# Altium project Charger_V01.PrjPcb
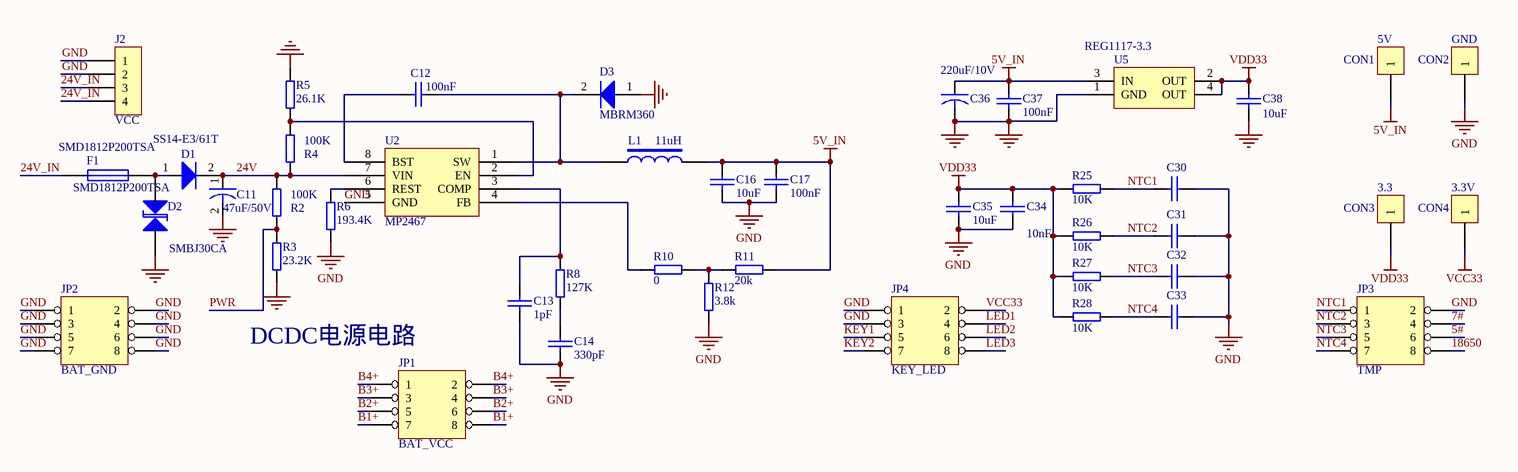
[diagram p0: Charger_Power_V01.SchDoc]
3 sheets, 103 parts. Net scope: global (net labels, ports and power ports of the same name join across sheets).
Board file: Chargerv01.PcbDoc
Sheets:
  Charger_Power_V01.SchDoc
  Charger_MCU_V01.SchDoc
  Charger_BIC_V01.SchDoc

## Sheet Charger_Power_V01.SchDoc
size A4

### Parts
(Parts that share a designator on the sheet are numbered #1, #2 ... from top to bottom, then left to right.)
3.3  CON3  [TP1]
3.3V  CON4  [TP1]
5V  CON1  [TP1]
C11  value 47uF/50V  [C1206]  (hidden comment: UUD1H470MCL1GS)
C12  value 100nF  [C0603]  (hidden comment: CC0603JRNPO9BN471)
C13  value 1pF  [C0603]  (hidden comment: CC0603JRNPO9BN471)
C14  value 330pF  [C0603]  (hidden comment: CC0603JRNPO9BN471)
C16  value 10uF  [C0805]  (hidden comment: CC0805ZKY5V6BB106)
C17  value 100nF  [C0603]  (hidden comment: CC0603JRNPO9BN471)
C30  C0603  [C0603]  (value not drawn)
C31  C0603  [C0603]  (value not drawn)
C32  C0603  [C0603]  (value not drawn)
C33  C0603  [C0603]  (value not drawn)
C34  value 10nF  [C0603]  (hidden comment: CC0603KRX7R9BB103)
C35  value 10uF  [C0805]  (hidden comment: CC0805ZKY5V6BB106)
C36  value 220uF/10V  [C6032]  (hidden comment: TAJC227K010RNJ)
C37  value 100nF  [C0603]  (hidden comment: CC0603ZRY5V9BB104)
C38  value 10uF  [C0805]  (hidden comment: CC0805ZKY5V6BB106)
D1  SS14-E3/61T  [D3528]
D2  SMBJ30CA  [D3528]
D3  value MBRM360  [D3528]  (hidden comment: SS14-E3/61T)
F1  SMD1812P200TSA  [R1812]
GND  CON2  [TP1]
J2  VCC  [SWIP4-2.54]
JP1  BAT_VCC  [IDC8(2.0mm)]
JP2  BAT_GND  [IDC8(2.0mm)]
JP3  TMP  [IDC8(2.0mm)]
JP4  KEY_LED  [IDC8(2.54mm)]
L1  value 11uH  [CD52]  (hidden comment: CD54NP-221KC)
R2  value 100K  [R0603]  (hidden comment: RC0603JR-071KL)
R3  value 23.2K  [R0603]  (hidden comment: RC0603JR-073KL)
R4  value 100K  [R0603]  (hidden comment: RC0603JR-071KL)
R5  value 26.1K  [R0603]  (hidden comment: RC0603JR-073KL)
R6  value 193.4K  [R0603]  (hidden comment: RC0603JR-073KL)
R8  value 127K  [R0603]  (hidden comment: RC0603JR-073KL)
R10  value 0  [R0603]  (hidden comment: RC0603JR-071KL)
R11  value 20k  [R0603]  (hidden comment: RC0603JR-071KL)
R12  value 3.8k  [R0603]  (hidden comment: RC0603JR-071KL)
R25  value 10K  [R0603]  (hidden comment: RC0603JR-0710KL)
R26  value 10K  [R0603]  (hidden comment: RC0603JR-0710KL)
R27  value 10K  [R0603]  (hidden comment: RC0603JR-0710KL)
R28  value 10K  [R0603]  (hidden comment: RC0603JR-0710KL)
U2  MP2467  [SO8]
U5#1  value REG1117-3.3  [SOT223]  (hidden comment: REG1117-3.3/2K5)

### Nets
5V_IN: 5V.1 C16.2 C17.1 C36.1 C37.2 L1.2 R11.1 U5#1.3(IN)
GND: C11.2 C13.1 C14.1 C16.1 C17.2 C30.1 C31.1 C32.1 C33.1 C34.2 C35.2 C36.2 C37.1 C38.2 D2.1 D3.1 GND.1 J2.1 J2.2 JP2.1 JP2.2 JP2.3 JP2.4 JP2.5 JP2.6 JP2.7 JP2.8 JP3.2 JP4.1 JP4.3 R3.1 R5.1 R6.2 R12.2 U2.5(GND) U5#1.1(GND)
VCC33: 3.3V.1 JP4.2
VDD33: 3.3.1 C34.1 C35.1 C38.1 R25.1 R26.1 R27.1 R28.1 U5#1.2(OUT) U5#1.4(OUT)
5#: JP3.6
7#: JP3.4
24V: C11.1 D1.2 R2.2 R4.1 U2.7(VIN)
24V_IN: F1.1 J2.3 J2.4
18650: JP3.8
B1+: JP1.7 JP1.8
B2+: JP1.5 JP1.6
B3+: JP1.3 JP1.4
B4+: JP1.1 JP1.2
KEY1: JP4.5
KEY2: JP4.7
LED1: JP4.4
LED2: JP4.6
LED3: JP4.8
NTC1: C30.2 JP3.1 R25.2
NTC2: C31.2 JP3.3 R26.2
NTC3: C32.2 JP3.5 R27.2
NTC4: C33.2 JP3.7 R28.2
PWR: R2.1 R3.2
NetC12_1: C12.1 U2.8(BST)
NetC12_2: C12.2 D3.2 L1.1 U2.1(SW)
NetC13_2: C13.2 R8.2 U2.3(COMP)
NetC14_2: C14.2 R8.1
NetD1_1: D1.1 D2.2 F1.2
NetR4_2: R4.2 R5.2 U2.2(EN)
NetR6_1: R6.1 U2.6(REST)
NetR10_1: R10.1 R11.2 R12.1
NetR10_2: R10.2 U2.4(FB)

### Notes on the sheet
- DCDC电源电路

### Library data of the parts
3.3 3.3V 5V GND = CON1: Connector
C11 = CAP_SMD_47uF/50V: CAP ALUM 47UF 50V 20% SMD; Manufacturer: Nichicon; Unit Cost: 0.3; Category: Capacitors; Manufacturer Part Number: UUD1H470MCL1GS; Part Number: UUD1H470MCL1GS; RoHs: Lead free / RoHS Compliant; Subcategory: Aluminum Capacitors
C12-C14 C17 = C0603_470p: CAP CER 470PF 50V 5% NPO 0603; Manufacturer: Yageo; Unit Cost: 0.04; Category: Capacitors; Manufacturer Part Number: CC0603JRNPO9BN471; Part Number: CC0603JRNPO9BN471; RoHs: Lead free / RoHS Compliant; Subcategory: Ceramic Capacitors
C16 C35 C38 = C0805_10uF: CAP CER 10UF 10V Y5V 0805; Manufacturer: Yageo; Unit Cost: 0.08; Category: Capacitors; Manufacturer Part Number: CC0805ZKY5V6BB106; Part Number: CC0805ZKY5V6BB106; RoHs: Lead free / RoHS Compliant; Subcategory: Ceramic Capacitors
C30-C33 = C0603: Unit Cost: 0.04
C34 = C0603_10nF: CAP CER 10000PF 50V 10% X7R 0603; Manufacturer: Yageo; Unit Cost: 0.04; Category: Capacitors; Manufacturer Part Number: CC0603KRX7R9BB103; Part Number: CC0603KRX7R9BB103; RoHs: Lead free / RoHS Compliant; Subcategory: Ceramic Capacitors
C36 = C6032_220uF_10V: CAP TANT 220UF 10V 10% 2312; Manufacturer: AVX Corporation; Unit Cost: 0.3; Category: Capacitors; Manufacturer Part Number: TAJC227K010RNJ; Part Number: TAJC227K010RNJ; RoHs: Lead free / RoHS Compliant; Subcategory: Tantalum Capacitors
C37 = C0603_100nF: CAP CER 0.1UF 50V Y5V 0603; Manufacturer: Yageo; Unit Cost: 0.04; Category: Capacitors; Manufacturer Part Number: CC0603ZRY5V9BB104; Part Number: CC0603ZRY5V9BB104; Subcategory: Ceramic Capacitors
D1 D3 = D3528_SS14: DIODE SCHOTTKY 40V 1A DO214AC; Manufacturer: Vishay; Unit Cost: 0.2; Category: Diodes; Manufacturer Part Number: SS14-E3/61T; Part Number: SS14-E3/61T; Subcategory: Diodes, Rectifiers - Single
  D1: Value: SS14-E3/61T
D2 = D3528_TVS_30: TVS DIODE 30VWM 48.4VC SMB; Manufacturer: Littelfuse Inc; Unit Cost: 0.3; Category: Circuit Protection; Manufacturer Part Number: SMBJ30CA; Part Number: SMBJ30CA; Subcategory: TVS - Diodes; Value: SMBJ30CA
F1 = FUSE1: FUSE RESETTABLE 2A  1812; Manufacturer: Littelfuse Inc; Unit Cost: 0.25; Category: Circuit Protection; Manufacturer Part Number: SMD1812P200TSA; Part Number: SMD1812P200TSA; Subcategory: Fuses; Value: SMD1812P200TSA
J2 = CON4: Connector
JP1 JP2 = HEADER 4X2-IDC8
JP3 = HEADER 4X2-IDC8: Value: NTC
JP4 = HEADER 4X2(2.54mm)
L1 = INDUCTOR_CD54: INDUCTOR POWER 220UH 10% SMD; Manufacturer: Sumida America Components Inc; Unit Cost: 0.4; Category: Inductors; Manufacturer Part Number: CD54NP-221KC; Part Number: CD54NP-221KC; Subcategory: Fixed Inductors
R2 R4 R10-R12 = R0603_1K_5%: RES 1.0K OHM 1/10W 5% 0603 SMD; Manufacturer: Yageo; Unit Cost: 0.005; Category: Resistor; Manufacturer Part Number: RC0603JR-071KL; Part Number: RC0603JR-071KL; RoHs: Lead free / RoHS Compliant; Subcategory: ThickFilm
R3 R5 R6 R8 = R0603_3K_5%: RES 3.0K OHM 1/10W 5% 0603 SMD; Manufacturer: Yageo; Unit Cost: 0.005; Category: Resistor; Manufacturer Part Number: RC0603JR-073KL; Part Number: RC0603JR-073KL; RoHs: Lead free / RoHS Compliant; Subcategory: ThickFilm
R25-R28 = R0603_10K_5%: RES 10K OHM 1/10W 5% 0603 SMD; Manufacturer: Yageo; Unit Cost: 0.005; Category: Resistor; Manufacturer Part Number: RC0603JR-0710KL; Part Number: RC0603JR-0710KL; RoHs: Lead free / RoHS Compliant; Subcategory: ThickFilm
U2 = MP2467: input range:6-36V; Manufacturer: Analog; Value: IN:6-36V;OUTmax:30V; Category: Integrated Circuits (ICs); Manufacturer Part Number: MP2467; Part Number: MP2467; Subcategory: IN:6-36V
U5#1 = REG1117-3.3: IC REG LDO 3.3V 0.8A SOT223; Manufacturer: Texas Instruments; Category: Integrated Circuits (ICs); Manufacturer Part Number: REG1117-3.3/2K5; Part Number: REG1117-3.3/2K5; RoHs: Lead free / RoHS Compliant; Subcategory: PMIC - Voltage Regulators - Linear (LDO)

## Sheet Charger_MCU_V01.SchDoc
size A4
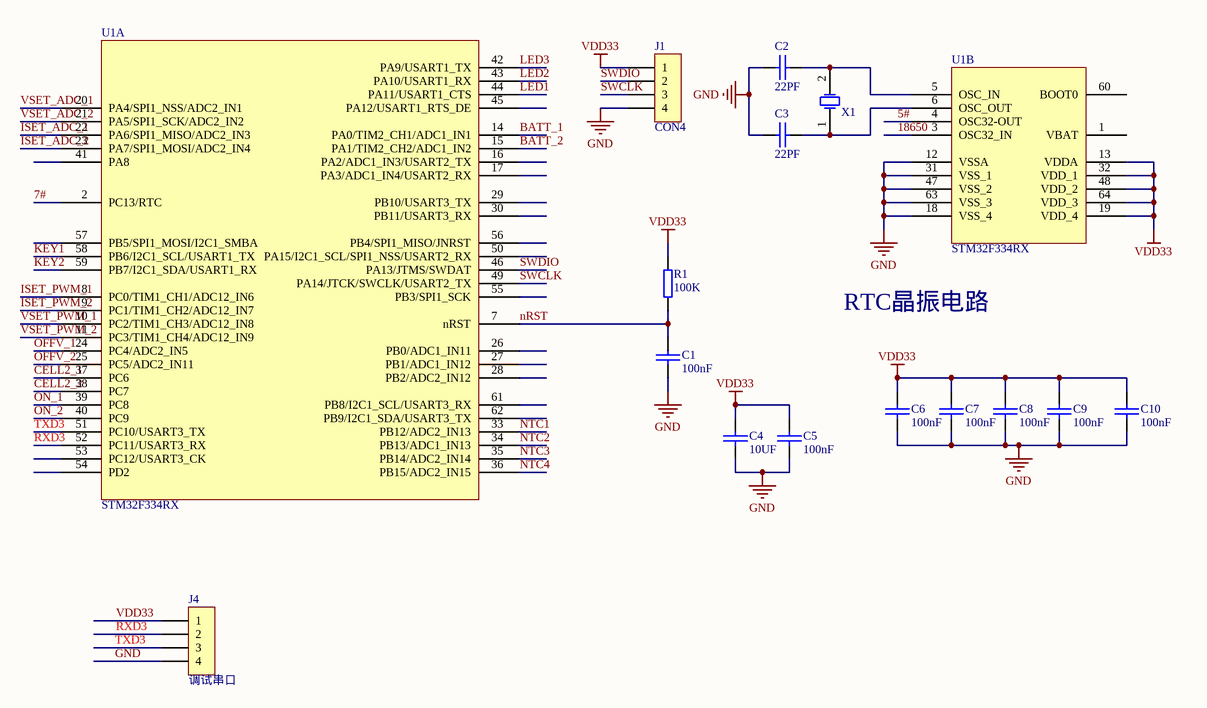
[diagram p1: Charger_MCU_V01.SchDoc]

### Parts
C1  value 100nF  [C0603]  (hidden comment: CC0603ZRY5V9BB104)
C2  value 22PF  [C0603]  (hidden comment: C0603)
C3  value 22PF  [C0603]  (hidden comment: C0603)
C4  value 10UF  [C0603]  (hidden comment: CC0603ZRY5V9BB106)
C5  value 100nF  [C0603]  (hidden comment: CC0603ZRY5V9BB104)
C6  value 100nF  [C0603]  (hidden comment: CC0603ZRY5V9BB104)
C7  value 100nF  [C0603]  (hidden comment: CC0603ZRY5V9BB104)
C8  value 100nF  [C0603]  (hidden comment: CC0603ZRY5V9BB104)
C9  value 100nF  [C0603]  (hidden comment: CC0603ZRY5V9BB104)
C10  value 100nF  [C0603]  (hidden comment: CC0603ZRY5V9BB104)
J1  CON4  [SIP4]
J4  调试串口  [SIP4]
R1  value 100K  [R0603]  (hidden comment: R0603)
U1  value STM32F334RX  [LQFP64]  (hidden comment: STM32F103R8T6)  (parts A,B of 2)
X1  9C-8.000MBBK-T  [XTAL2]  (value not drawn)

### Nets
GND: C1.2 C2.1 C3.1 C4.2 C5.2 C6.2 C7.2 C8.2 C9.2 C10.2 J1.4 J4.4 U1.12(VSSA) U1.18(VSS_4) U1.31(VSS_1) U1.47(VSS_2) U1.63(VSS_3)
VDD33: C4.1 C5.1 C6.1 C7.1 C8.1 C9.1 C10.1 J1.1 J4.1 R1.2 U1.13(VDDA) U1.19(VDD_4) U1.32(VDD_1) U1.48(VDD_2) U1.64(VDD_3)
5#: U1.4(OSC32-OUT)
7#: U1.2(PC13/RTC)
18650: U1.3(OSC32_IN)
BATT_1: U1.14(PA0/TIM2_CH1/ADC1_IN1)
BATT_2: U1.15(PA1/TIM2_CH2/ADC1_IN2)
CELL2_1: U1.37(PC6)
CELL2_2: U1.38(PC7)
ISET_ADC_1: U1.22(PA6/SPI1_MISO/ADC2_IN3)
ISET_ADC_2: U1.23(PA7/SPI1_MOSI/ADC2_IN4)
ISET_PWM_1: U1.8(PC0/TIM1_CH1/ADC12_IN6)
ISET_PWM_2: U1.9(PC1/TIM1_CH2/ADC12_IN7)
KEY1: U1.58(PB6/I2C1_SCL/USART1_TX)
KEY2: U1.59(PB7/I2C1_SDA/USART1_RX)
LED1: U1.44(PA11/USART1_CTS)
LED2: U1.43(PA10/USART1_RX)
LED3: U1.42(PA9/USART1_TX)
nRST: C1.1 R1.1 U1.7(nRST)
NTC1: U1.33(PB12/ADC2_IN13)
NTC2: U1.34(PB13/ADC1_IN13)
NTC3: U1.35(PB14/ADC2_IN14)
NTC4: U1.36(PB15/ADC2_IN15)
OFFV_1: U1.24(PC4/ADC2_IN5)
OFFV_2: U1.25(PC5/ADC2_IN11)
ON_1: U1.39(PC8)
ON_2: U1.40(PC9)
RXD3: J4.2 U1.52(PC11/USART3_RX)
SWCLK: J1.3 U1.49(PA14/JTCK/SWCLK/USART2_TX)
SWDIO: J1.2 U1.46(PA13/JTMS/SWDAT)
TXD3: J4.3 U1.51(PC10/USART3_TX)
VSET_ADC_1: U1.20(PA4/SPI1_NSS/ADC2_IN1)
VSET_ADC_2: U1.21(PA5/SPI1_SCK/ADC2_IN2)
VSET_PWM_1: U1.10(PC2/TIM1_CH3/ADC12_IN8)
VSET_PWM_2: U1.11(PC3/TIM1_CH4/ADC12_IN9)
NetC2_2: C2.2 U1.5(OSC_IN) X1.2(OSC2)
NetC3_2: C3.2 U1.6(OSC_OUT) X1.1(OSC1)

Not connected (* = marked no-connect by the designer): U1 1(VBAT) 16(PA2/ADC1_IN3/USART2_TX) 17(PA3/ADC1_IN4/USART2_RX) 26(PB0/ADC1_IN11) 27(PB1/ADC1_IN12) 28(PB2/ADC2_IN12) 29(PB10/USART3_TX) 30(PB11/USART3_RX) 41(PA8) 45(PA12/USART1_RTS_DE) 50(PA15/I2C1_SCL/SPI1_NSS/USART2_RX) 53(PC12/USART3_CK) 54(PD2) 55(PB3/SPI1_SCK) 56(PB4/SPI1_MISO/JNRST) 57(PB5/SPI1_MOSI/I2C1_SMBA) 60(BOOT0) 61(PB8/I2C1_SCL/USART3_RX) 62(PB9/I2C1_SDA/USART3_TX)

### Notes on the sheet
- RTC晶振电路

### Library data of the parts
C1 = C0603: CAP CER 0.1UF 50V Y5V 0603; Manufacturer: Yageo; Unit Cost: 0.04; Category: Capacitors; Manufacturer Part Number: CC0603ZRY5V9BB104; Part Number: CC0603ZRY5V9BB104
C2 C3 = C0603: CAP CER 22PF 50V Y5V 0603; Unit Cost: 0.04; Category: Capacitors
C4 = C0603: CAP CER 10UF 50V Y5V 0603; Manufacturer: Yageo; Unit Cost: 0.04; Category: Capacitors; Manufacturer Part Number: CC0603ZRY5V9BB106; Part Number: CC0603ZRY5V9BB106
C5-C10 = C0603: CAP CER 100nF 50V Y5V 0603; Manufacturer: Yageo; Unit Cost: 0.04; Category: Capacitors; Manufacturer Part Number: CC0603ZRY5V9BB104; Part Number: CC0603ZRY5V9BB104
  C6: Subcategory: Ceramic Capacitors
J1 = CON4: 2.54mm 程序下载口
J4 = CON4: 2.54mm dip
R1 = R0603: RES 100K OHM 1/10W 5% 0603 SMD; Manufacturer: Yageo; Unit Cost: 0.005; Category: Resistor; RoHs: Lead free / RoHS Compliant; Subcategory: ThickFilm
U1 = STM32F334RX: MCU ARM 64KB FLASH MEM 64-LQFP; Manufacturer: STMicroelectronics; Unit Cost: 9.5; Category: Integrated Circuits (ICs); Manufacturer Part Number: STM32F103R8T6; Part Number: STM32F103R8T6; RoHs: Lead free / RoHS Compliant; Subcategory: STM32 F1
X1 = CRYSTAL-XTAL2: CRYSTAL 8.000MHZ 20PF SMD; Manufacturer: TXC CORPORATION; Value: 8M; Unit Cost: 0.25; Category: Crystals; Manufacturer Part Number: 9C-8.000MBBK-T; Part Number: 9C-8.000MBBK-T; RoHs: Lead free / RoHS Compliant; Subcategory: HC-49S

## Sheet Charger_BIC_V01.SchDoc
size A4
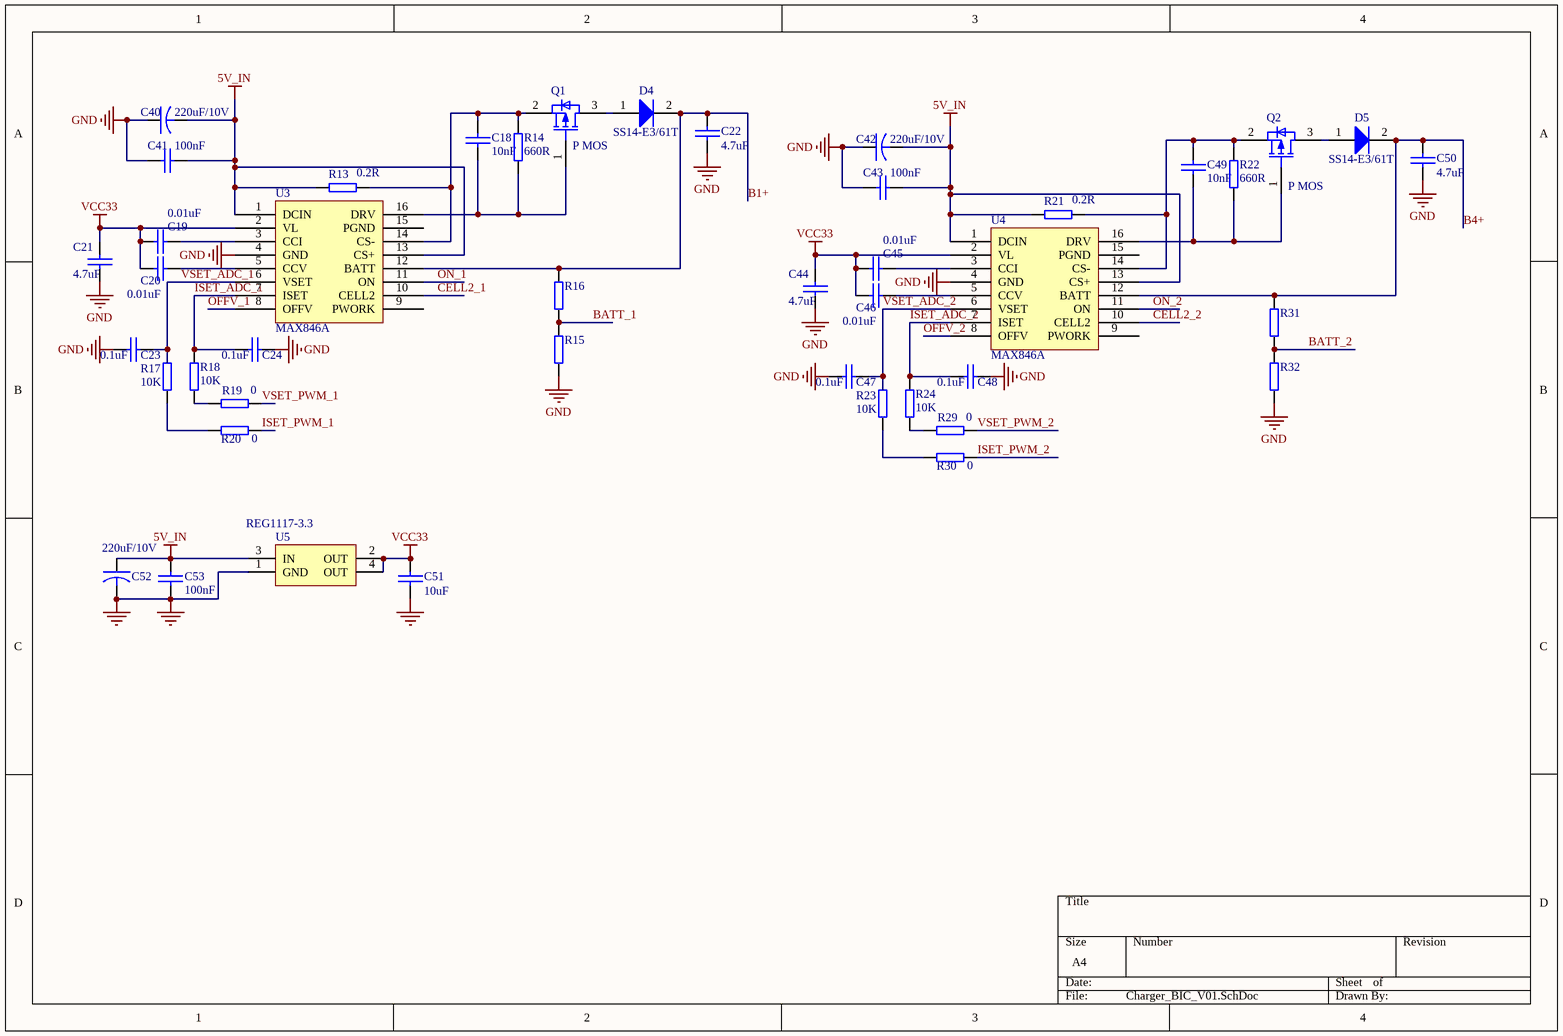
[diagram p2: Charger_BIC_V01.SchDoc]

### Parts
(Parts that share a designator on the sheet are numbered #1, #2 ... from top to bottom, then left to right.)
C18  value 10nF  [C0603]  (hidden comment: C0603)
C19  value 0.01uF  [C0603]  (hidden comment: C0603)
C20  value 0.01uF  [C0603]  (hidden comment: C0603)
C21  value 4.7uF  [C0603]  (hidden comment: C0603)
C22  value 4.7uF  [C0805]  (hidden comment: C0805)
C23  value 0.1uF  [C0603]  (hidden comment: C0603)
C24  value 0.1uF  [C0603]  (hidden comment: C0603)
C40  value 220uF/10V  [C6032]  (hidden comment: TAJC227K010RNJ)
C41  value 100nF  [C0603]  (hidden comment: CC0603ZRY5V9BB104)
C42  value 220uF/10V  [C6032]  (hidden comment: TAJC227K010RNJ)
C43  value 100nF  [C0603]  (hidden comment: CC0603ZRY5V9BB104)
C44  value 4.7uF  [C0603]  (hidden comment: C0603)
C45  value 0.01uF  [C0603]  (hidden comment: C0603)
C46  value 0.01uF  [C0603]  (hidden comment: C0603)
C47  value 0.1uF  [C0603]  (hidden comment: C0603)
C48  value 0.1uF  [C0603]  (hidden comment: C0603)
C49  value 10nF  [C0603]  (hidden comment: C0603)
C50  value 4.7uF  [C0805]  (hidden comment: C0805)
C51  value 10uF  [C0805]  (hidden comment: CC0805ZKY5V6BB106)
C52  value 220uF/10V  [C6032]  (hidden comment: TAJC227K010RNJ)
C53  value 100nF  [C0603]  (hidden comment: CC0603ZRY5V9BB104)
D4  SS14-E3/61T  [D3528]
D5  SS14-E3/61T  [D3528]
Q1  P MOS  [SOT23]
Q2  P MOS  [SOT23]
R13  value 0.2R  [R0603]  (hidden comment: R0603)
R14  value 660R  [R0603]  (hidden comment: RC0603JR-0720KL)
R15  R0603  [R0603]  (value not drawn)
R16  R0603  [R0603]  (value not drawn)
R17  value 10K  [R0603]  (hidden comment: RC0603JR-0710KL)
R18  value 10K  [R0603]  (hidden comment: RC0603JR-0710KL)
R19  value 0  [R0603]  (hidden comment: R0603)
R20  value 0  [R0603]  (hidden comment: R0603)
R21  value 0.2R  [R0603]  (hidden comment: R0603)
R22  value 660R  [R0603]  (hidden comment: RC0603JR-0720KL)
R23  value 10K  [R0603]  (hidden comment: RC0603JR-0710KL)
R24  value 10K  [R0603]  (hidden comment: RC0603JR-0710KL)
R29  value 0  [R0603]  (hidden comment: R0603)
R30  value 0  [R0603]  (hidden comment: R0603)
R31  R0603  [R0603]  (value not drawn)
R32  R0603  [R0603]  (value not drawn)
U3  MAX846A  [QSOP16]
U4  MAX846A  [QSOP16]
U5#2  value REG1117-3.3  [SOT223]  (hidden comment: REG1117-3.3/2K5)

### Nets
5V_IN: C40.2 C41.1 C42.2 C43.1 C52.1 C53.2 R13.2 R21.2 U3.1(DCIN) U3.13(CS+) U4.1(DCIN) U4.13(CS+) U5#2.3(IN)
GND: C21.2 C22.2 C23.1 C24.2 C40.1 C41.2 C42.1 C43.2 C44.2 C47.1 C48.2 C50.2 C51.2 C52.2 C53.1 R15.1 R32.1 U3.4(GND) U4.4(GND) U5#2.1(GND)
VCC33: C19.1 C20.1 C21.1 C44.1 C45.1 C46.1 C51.1 U3.2(VL) U4.2(VL) U5#2.2(OUT) U5#2.4(OUT)
B1+: C22.1 D4.2 R16.2 U3.12(BATT)
B4+: C50.1 D5.2 R31.2 U4.12(BATT)
BATT_1: R15.2 R16.1
BATT_2: R31.1 R32.2
CELL2_1: U3.10(CELL2)
CELL2_2: U4.10(CELL2)
ISET_ADC_1: C24.1 R18.1 U3.7(ISET)
ISET_ADC_2: C48.1 R24.1 U4.7(ISET)
ISET_PWM_1: R20.1
ISET_PWM_2: R30.1
OFFV_1: U3.8(OFFV)
OFFV_2: U4.8(OFFV)
ON_1: U3.11(ON)
ON_2: U4.11(ON)
VSET_ADC_1: C23.2 R17.1 U3.6(VSET)
VSET_ADC_2: C47.2 R23.1 U4.6(VSET)
VSET_PWM_1: R19.1
VSET_PWM_2: R29.1
NetC18_1: C18.1 Q1.1(G) R14.1 U3.16(DRV)
NetC18_2: C18.2 Q1.2(S) R13.1 R14.2 U3.14(CS-)
NetC19_2: C19.2 U3.3(CCI)
NetC20_2: C20.2 U3.5(CCV)
NetC45_2: C45.2 U4.3(CCI)
NetC46_2: C46.2 U4.5(CCV)
NetC49_1: C49.1 Q2.1(G) R22.1 U4.16(DRV)
NetC49_2: C49.2 Q2.2(S) R21.1 R22.2 U4.14(CS-)
NetD4_1: D4.1 Q1.3(D)
NetD5_1: D5.1 Q2.3(D)
NetR17_2: R17.2 R20.2
NetR18_2: R18.2 R19.2
NetR23_2: R23.2 R30.2
NetR24_2: R24.2 R29.2

Not connected (* = marked no-connect by the designer): U3 9(PWORK) 15(PGND); U4 9(PWORK) 15(PGND)

### Library data of the parts
C18-C21 C23 C24 C44-C49 = C0603: Unit Cost: 0.04
C40 C42 C52 = C6032_220uF_10V: as C36 on sheet Charger_Power_V01; Category: Capacitors; Manufacturer Part Number: TAJC227K010RNJ; Part Number: TAJC227K010RNJ; RoHs: Lead free / RoHS Compliant; Subcategory: Tantalum Capacitors
C41 C43 C53 = C0603_100nF: as C37 on sheet Charger_Power_V01; Category: Capacitors; Manufacturer Part Number: CC0603ZRY5V9BB104; Part Number: CC0603ZRY5V9BB104; Subcategory: Ceramic Capacitors
C51 = C0805_10uF: as C16 on sheet Charger_Power_V01; Category: Capacitors; Manufacturer Part Number: CC0805ZKY5V6BB106; Part Number: CC0805ZKY5V6BB106; RoHs: Lead free / RoHS Compliant; Subcategory: Ceramic Capacitors
D4 D5 = D3528_SS14: as D1 on sheet Charger_Power_V01; Category: Diodes; Manufacturer Part Number: SS14-E3/61T; Part Number: SS14-E3/61T; Subcategory: Diodes, Rectifiers - Single; Value: SS14-E3/61T
Q1 Q2 = P MOS: MOS7002
R13 R15 R16 R19-R21 R29-R32 = R0603: Manufacturer: Yageo; Unit Cost: 0.005; Category: Resistor; RoHs: Lead free / RoHS Compliant; Subcategory: ThickFilm
R14 R22 = R0603_20K_5%: RES 20K OHM 1/10W 5% 0603 SMD; Manufacturer: Yageo; Unit Cost: 0.005; Category: Resistor; Manufacturer Part Number: RC0603JR-0720KL; Part Number: RC0603JR-0720KL; RoHs: Lead free / RoHS Compliant; Subcategory: ThickFilm
R17 R18 R23 R24 = R0603_10K_5%: as R25 on sheet Charger_Power_V01; Category: Resistor; Manufacturer Part Number: RC0603JR-0710KL; Part Number: RC0603JR-0710KL; RoHs: Lead free / RoHS Compliant; Subcategory: ThickFilm
U3 U4 = MAX846A: Battery-Charger
U5#2 = REG1117-3.3: as U5#1 on sheet Charger_Power_V01; Category: Integrated Circuits (ICs); Manufacturer Part Number: REG1117-3.3/2K5; Part Number: REG1117-3.3/2K5; RoHs: Lead free / RoHS Compliant; Subcategory: PMIC - Voltage Regulators - Linear (LDO)

## Nets that join several sheets
5V_IN: Charger_Power_V01 (8 pins), Charger_BIC_V01 (13 pins)
GND: Charger_Power_V01 (36 pins), Charger_MCU_V01 (17 pins), Charger_BIC_V01 (20 pins)
VCC33: Charger_Power_V01 (3.3V.1 JP4.2), Charger_BIC_V01 (11 pins)
VDD33: Charger_Power_V01 (10 pins), Charger_MCU_V01 (15 pins)
5#: Charger_Power_V01 (JP3.6), Charger_MCU_V01 (U1.4)
7#: Charger_Power_V01 (JP3.4), Charger_MCU_V01 (U1.2)
18650: Charger_Power_V01 (JP3.8), Charger_MCU_V01 (U1.3)
B1+: Charger_Power_V01 (JP1.7 JP1.8), Charger_BIC_V01 (C22.1 D4.2 R16.2 U3.12)
B4+: Charger_Power_V01 (JP1.1 JP1.2), Charger_BIC_V01 (C50.1 D5.2 R31.2 U4.12)
BATT_1: Charger_MCU_V01 (U1.14), Charger_BIC_V01 (R15.2 R16.1)
BATT_2: Charger_MCU_V01 (U1.15), Charger_BIC_V01 (R31.1 R32.2)
CELL2_1: Charger_MCU_V01 (U1.37), Charger_BIC_V01 (U3.10)
CELL2_2: Charger_MCU_V01 (U1.38), Charger_BIC_V01 (U4.10)
ISET_ADC_1: Charger_MCU_V01 (U1.22), Charger_BIC_V01 (C24.1 R18.1 U3.7)
ISET_ADC_2: Charger_MCU_V01 (U1.23), Charger_BIC_V01 (C48.1 R24.1 U4.7)
ISET_PWM_1: Charger_MCU_V01 (U1.8), Charger_BIC_V01 (R20.1)
ISET_PWM_2: Charger_MCU_V01 (U1.9), Charger_BIC_V01 (R30.1)
KEY1: Charger_Power_V01 (JP4.5), Charger_MCU_V01 (U1.58)
KEY2: Charger_Power_V01 (JP4.7), Charger_MCU_V01 (U1.59)
LED1: Charger_Power_V01 (JP4.4), Charger_MCU_V01 (U1.44)
LED2: Charger_Power_V01 (JP4.6), Charger_MCU_V01 (U1.43)
LED3: Charger_Power_V01 (JP4.8), Charger_MCU_V01 (U1.42)
NTC1: Charger_Power_V01 (C30.2 JP3.1 R25.2), Charger_MCU_V01 (U1.33)
NTC2: Charger_Power_V01 (C31.2 JP3.3 R26.2), Charger_MCU_V01 (U1.34)
NTC3: Charger_Power_V01 (C32.2 JP3.5 R27.2), Charger_MCU_V01 (U1.35)
NTC4: Charger_Power_V01 (C33.2 JP3.7 R28.2), Charger_MCU_V01 (U1.36)
OFFV_1: Charger_MCU_V01 (U1.24), Charger_BIC_V01 (U3.8)
OFFV_2: Charger_MCU_V01 (U1.25), Charger_BIC_V01 (U4.8)
ON_1: Charger_MCU_V01 (U1.39), Charger_BIC_V01 (U3.11)
ON_2: Charger_MCU_V01 (U1.40), Charger_BIC_V01 (U4.11)
VSET_ADC_1: Charger_MCU_V01 (U1.20), Charger_BIC_V01 (C23.2 R17.1 U3.6)
VSET_ADC_2: Charger_MCU_V01 (U1.21), Charger_BIC_V01 (C47.2 R23.1 U4.6)
VSET_PWM_1: Charger_MCU_V01 (U1.10), Charger_BIC_V01 (R19.1)
VSET_PWM_2: Charger_MCU_V01 (U1.11), Charger_BIC_V01 (R29.1)